# EAGLE design p0-001 (EAGLE 9.5.2)
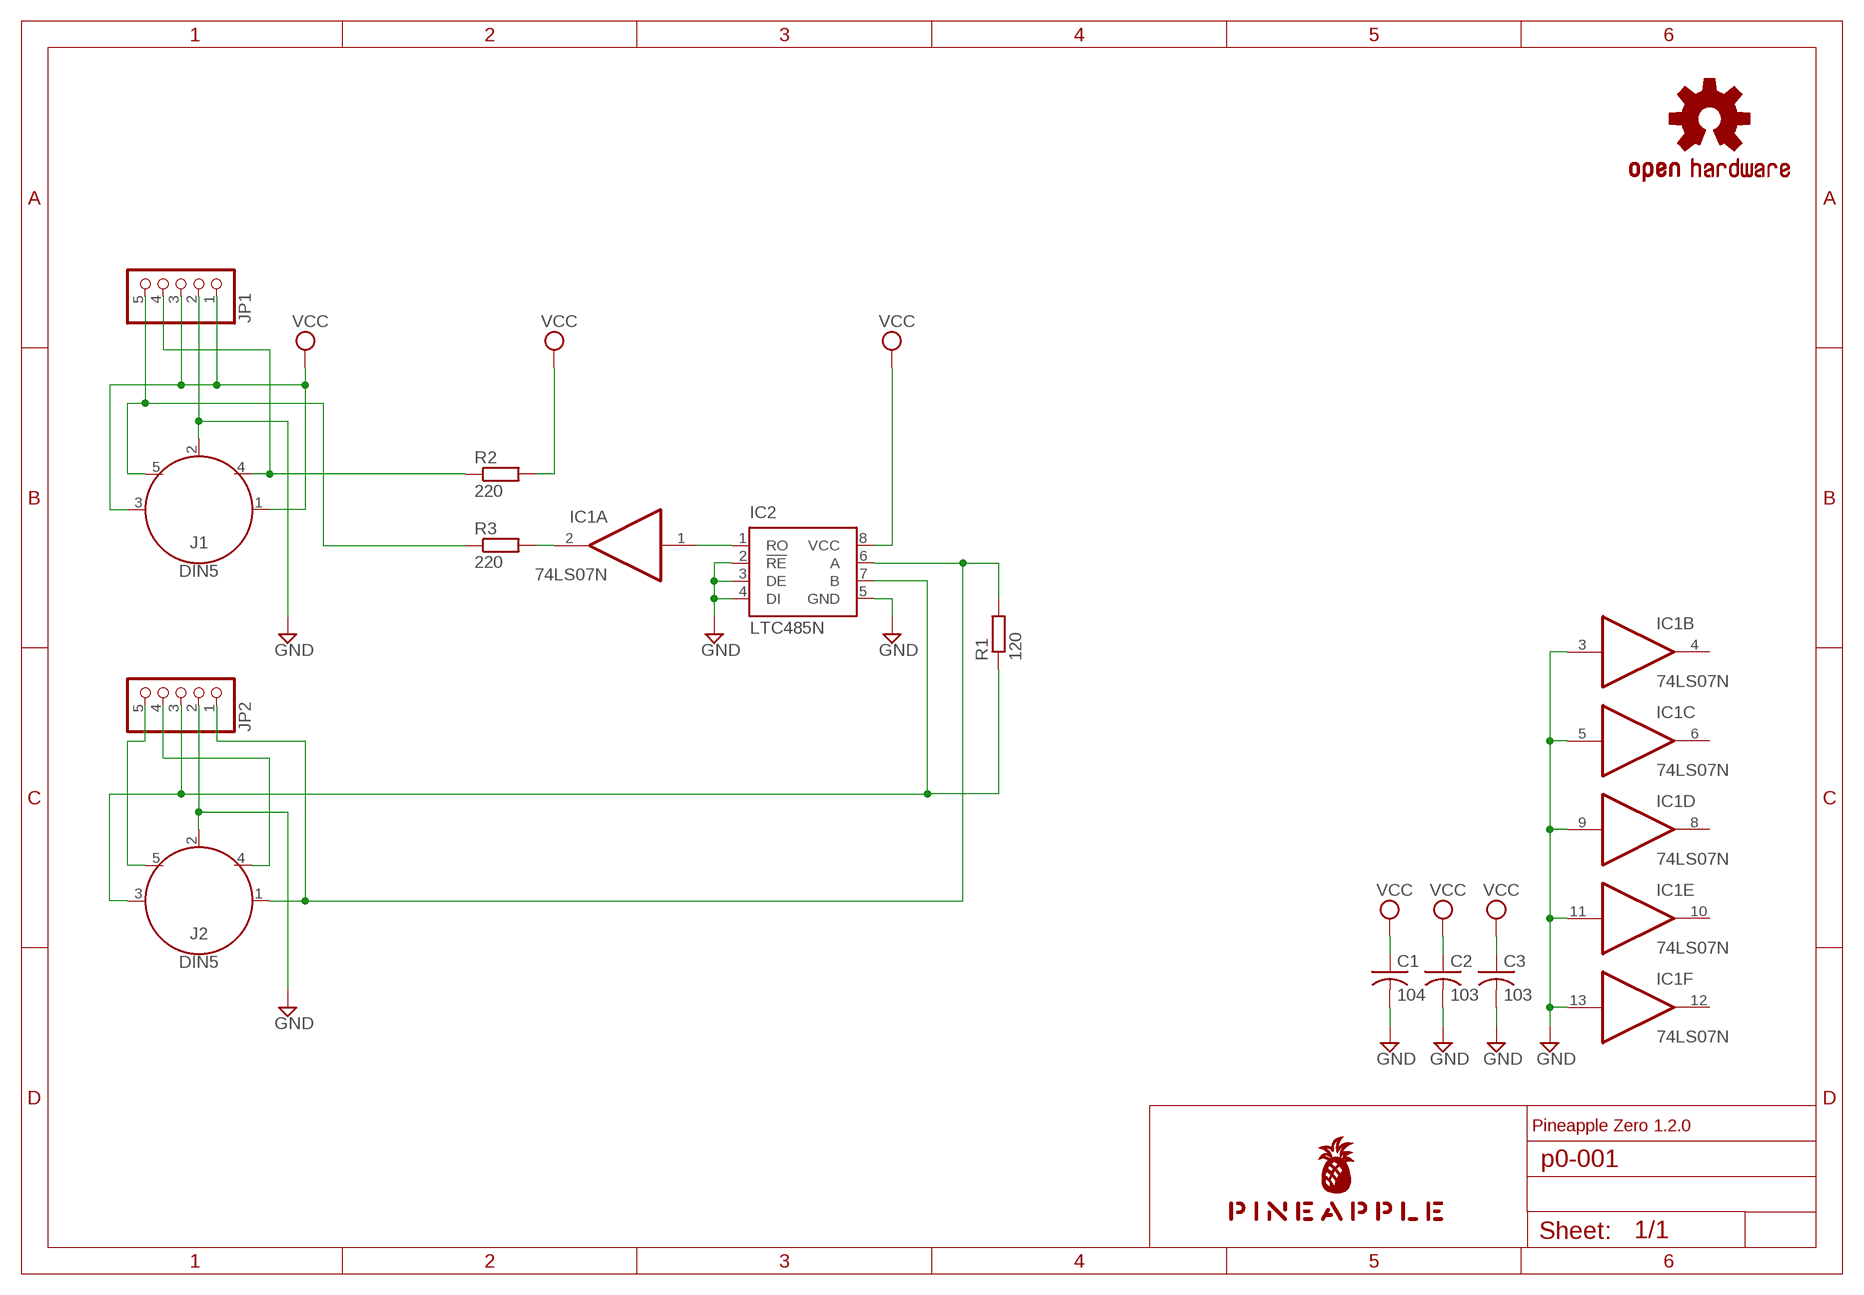
[diagram p0: schematic, sheet 1]

## Parts
C1  104  C-US025-025X050  [C025-025X050]
C2  103  C-US025-025X050  [C025-025X050]
C3  103  C-US025-025X050  [C025-025X050]
IC1  74LS07N  [DIL14]
IC2  LTC485N  [DIL08]
J1  DIN5  [DIN5-RA-PTH]
J2  DIN5  [DIN5-RA-PTH]
JP1  PINHD-1X5  [1X05]
JP2  PINHD-1X5  [1X05]
LOGO1  OSHW-LOGOS-COPPER  [OSHW-LOGO-S_COPPER]
R1  120  R-EU_0204/5  [0204/5]
R2  220  R-EU_0204/5  [0204/5]
R3  220  R-EU_0204/5  [0204/5]
U$1  PINEAPPLE450  [PINEAPPLE450]

## Nets
DUMMY4: J2.4 JP2.4
DUMMY5: J2.5 JP2.5
GND [power]: C1.2 C2.2 C3.2 IC1.3(B:I) IC1.5(C:I) IC1.9(D:I) IC1.11(E:I) IC1.13(F:I) IC2.2(!RE) IC2.3(DE) IC2.4(DI) IC2.5(GND) J1.2 J2.2 JP1.2 JP2.2
MOUTRTN: J1.5 JP1.5 R3.1
MOUTSND: J1.4 JP1.4 R2.1
N$1: IC1.2(A:O) R3.2
RX+: IC2.6(A) J2.1 JP2.1 R1.2
RX-: IC2.7(B) J2.3 JP2.3 R1.1
TX: IC1.1(A:I) IC2.1(RO)
VCC [power]: C1.1 C2.1 C3.1 IC2.8(VCC) J1.1 J1.3 JP1.1 JP1.3 R2.2
Unconnected: IC1.4(B:O) IC1.6(C:O) IC1.8(D:O) IC1.10(E:O) IC1.12(F:O)

## Notes on the sheet
- Pineapple Zero 1.2.0

## Power pins joined to a net without a drawn wire
GND: IC1.7(P:GND)
VCC: IC1.14(P:VCC)

## Library data of the parts
C1-C3 = rcl:C-US: CAPACITOR, American symbol; SPICEPREFIX: C
IC1 = 74xx-us:74*07: Hex BUFFER, open collector high-voltage output
IC2 = linear-technology:LTC485: Low Power RS485 Interface Transceiver Source: http://www.linear.com/pc/downloadDocument.do?navId=H0,C1,C1007,C1017,P2064,D1718; OC_FARNELL: unknown; OC_NEWARK: unknown
J1 J2 = SparkFun-Connectors:DIN5: DIN5 Connector - Female Right Angle (frequently used as a MIDI Jack connector) This type of connector and cable is frequently used for transmitting midi data (musical instrument digital interface). It is what you usually see on a keyboard or set of electronic drums. Learn more here <https://en.wikipedia.org/wiki/MIDI>. For more information on the pinout and electrical specifications of MIDI communications, please see the following resource: https://www.midi.org/specifications/item/midi-din-electrical-specification Here is the connector we sell at SparkFun: MIDI Connector - Female Right Angle <https://www.sparkfun.com/products/9536> (PRT-09536) Datasheet <hhttp://www.sparkfun.com/datasheets/Prototyping/Connectors/MIDI-RA.pdf> It is used on this SparkFun product: SparkFun MIDI Shield <https://www.sparkfun.com/products/12898> (DEV-12898); PROD_ID: CONN-09481
JP1 JP2 = pinhead:PINHD-1X5: PIN HEADER
LOGO1 = SparkFun-Aesthetics:OSHW-LOGO: Open-Source Hardware (OSHW) Logo This logo indicates the piece of hardware it is found on incorporates a OSHW license and/or adheres to the definition of open source hardware found here: http://freedomdefined.org/OSHW
R1-R3 = resistor:R-EU_: RESISTOR, European symbol
U$1 = pineapple:PINEAPPLE450

## Net classes
0 default: width 0.152 mm, drill 0.152 mm, clearance 0.152 mm
1 power: width 0.305 mm, drill 0.152 mm, clearance 0.152 mm to class 0, clearance 0.152 mm

## Board
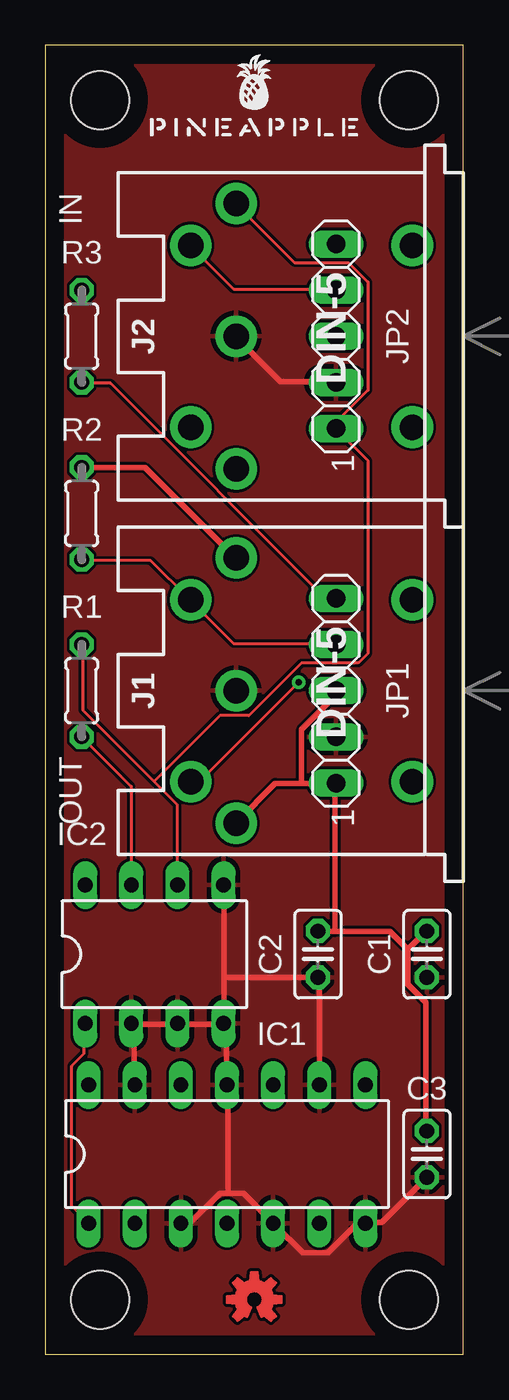
[diagram p1: board, top side]
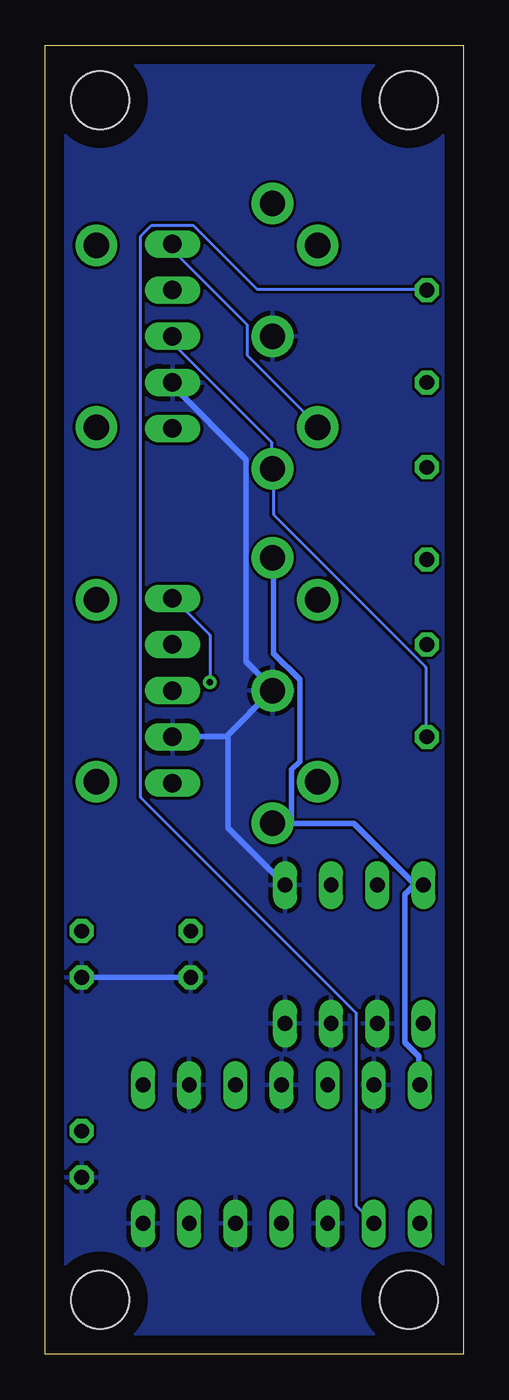
[diagram p2: board, bottom side, seen from below]

Size 23 x 72 mm. Coordinates in mm from the lower left corner, seen from the top.
Outline: 0,0 23,0 23,72 0,72 0,0
Copper layers (1*16): Top 0.035mm / dielectric 1.5mm / Bottom 0.035mm
Design rules "default": minimum track width 6mil, minimum drill 0.35mm, track to track 6mil, track to pad 6mil, pad to pad 6mil, via to via 6mil, smd to smd 6mil, copper to edge 40mil, drill to drill 6mil, minimum pad ring 10mil, minimum via ring 8mil, stop-mask expansion 4mil, vias tented up to drill 0mil, thermal gap 10mil
Holes 3.2 mm at 3,3 20,3 20,69 3,69
tRestrict: area 0,71 to 23,72; area 22,0 to 23,72; area 0,0 to 23,1; area 0,0 to 1,72
bRestrict: area 0,71 to 23,72; area 22,0 to 23,72; area 0,0 to 23,1; area 0,0 to 1,72

### Footprints (pad centres in the part's own frame; a part is rotated, then mirrored left to right if it is on the bottom)
C025-025X050 = drill 0.813 octagon: 1 -1.27,0; 2 1.27,0
DIL14 = drill 0.813 long: 1 -7.62,-3.81; 2 -5.08,-3.81; 3 -2.54,-3.81; 4 0,-3.81; 5 2.54,-3.81; 6 5.08,-3.81; 7 7.62,-3.81; 8 7.62,3.81; 9 5.08,3.81; 10 2.54,3.81; 11 0,3.81; 12 -2.54,3.81; 13 -5.08,3.81; 14 -7.62,3.81
DIL08 = drill 0.813 long: 1 -3.81,-3.81; 2 -1.27,-3.81; 3 1.27,-3.81; 4 3.81,-3.81; 5 3.81,3.81; 6 1.27,3.81; 7 -1.27,3.81; 8 -3.81,3.81
DIN5-RA-PTH = drill 1.4 pad 2.286: 1 7.3,12.5; 2 0,12.5; 3 -7.3,12.5; 4 5,15; 5 -5,15; 6 -5,2.8; 7 5,2.8
1X05 = drill 1.016 long: 1 -5.08,0; 2 -2.54,0; 3 0,0; 4 2.54,0; 5 5.08,0
0204/5 = drill 0.813 octagon: 1 -2.54,0; 2 2.54,0

### Placement (x,y rotation side)
C1  21,22 270 top
C2  15,22 270 top
C3  21,11 270 top
IC1  10,11 0 top
IC2  6,22 0 top
J1  23,36.5 90 top
J2  23,56 90 top
JP1  16,36.5 90 top
JP2  16,56 90 top
LOGO1  11.5,3 0 top
R1  2,36.5 90 top
R2  2,46.25 90 top
R3  2,56 90 top
U$1  11.5,67 0 top

### Tracks (layer width: path | path; a pad name or v marks a point on that pad's centre or on a via)
DUMMY4
  Top 0.152: JP2.4 15.93,58.6 10.36,58.6 8,60.96 J2.4
DUMMY5
  Bottom 0.152: JP2.5 15.93,61.04 15.93,60.66 11.89,56.62 11.89,54.94 8,51.05 J2.5
GND
  Top 0.305: JP2.2 15.93,53.49 12.95,53.49 10.52,55.93 J2.2 | IC1.13 4.88,14.86 4.88,18.06 4.8,18.14 IC2.2 4.95,18.14 7.24,18.14 IC2.3 7.39,18.14 9.68,18.14 IC2.4 | C3.2 20.95,9.68 18.52,7.24 17.68,7.24 IC1.7 17.53,7.09 17.07,7.09 15.54,5.56 14.17,5.56 12.65,7.09 IC1.5 12.5,7.24 10.9,8.84 10.06,8.84 | 10.06,8.84 9.6,8.84 8,7.24 7.47,7.24 IC1.3 | IC2.4 9.83,18.14 9.98,17.98 9.98,14.86 IC1.11 10.06,14.71 10.06,8.84 | 9.83,20.73 9.83,18.29 IC2.4 | 9.83,20.73 9.83,25.76 IC2.5 | 9.83,20.73 14.94,20.73 C2.2 15.09,20.65 15.09,14.86 IC1.9
  Bottom 0.305: 13.03,33.98 15.93,33.98 JP1.2 | 13.03,33.98 10.52,36.5 J1.2 10.52,36.65 11.96,38.1 11.96,49.23 15.93,53.19 15.93,53.42 JP2.2 | C1.2 20.95,20.73 C2.2 | 13.03,33.98 12.95,33.91 12.95,28.96 9.83,25.83 IC2.5
  pour Top: 0,0 23,0 23,72 0,72
  pour Bottom: 0,0 23,0 23,72 0,72
MOUTRTN  (via drill 0.35)
  Top 0.152: R3.1 2.06,53.42 3.58,53.42 15.39,41.6 15.93,41.6 JP1.5 | v13.95,36.96 8.53,31.55 8,31.55 J1.5
  Bottom 0.152: v13.95,36.96 13.95,39.55 15.93,41.53 JP1.5
MOUTSND
  Top 0.152: R2.1 2.06,43.66 5.79,43.66 7.92,41.53 J1.4 8,41.45 10.36,39.09 15.93,39.09 JP1.4
N$1
  Bottom 0.152: R3.2 2.06,58.6 11.35,58.6 14.86,62.1 17.14,62.1 17.75,61.49 17.75,30.63 5.87,18.75 5.87,8.15 4.95,7.24 IC1.2
RX+
  Top 0.152: 5.98,31.51 2.06,35.43 2.06,39.01 R1.2 | 5.98,31.51 7.24,30.25 7.24,25.83 IC2.6 | J2.1 10.52,63.25 13.72,60.05 16.69,60.05 17.75,58.98 17.75,53.03 16,51.28 16,50.98 JP2.1 16,50.9 17.75,49.15 17.75,38.56 17.22,38.02 14.1,38.02 11.2,35.13 9.6,35.13 5.98,31.51
RX-
  Top 0.152: IC2.7 4.72,25.83 4.72,31.24 2.06,33.91 R1.1
  Bottom 0.152: JP2.3 15.93,55.93 15.93,55.55 10.52,50.14 10.52,48.77 J2.3 10.44,48.69 10.44,46.18 2.06,37.8 2.06,33.98 R1.1
TX
  Top 0.152: IC2.1 2.13,18.14 2.13,16.54 1.45,15.85 1.45,8.15 2.36,7.24 IC1.1
VCC
  Top 0.305: 19.96,22.25 19.96,20.34 20.95,19.36 20.95,12.34 C3.1 | 19.96,22.25 20.95,23.24 C1.1 | 15.93,23.24 18.97,23.24 19.96,22.25 | 15.93,23.24 15.01,23.24 C2.1 | R2.2 2.06,48.77 5.49,48.77 10.44,43.81 J1.1 | 14.1,31.39 12.65,31.39 10.52,29.26 J1.3 | 14.1,31.39 15.93,31.39 JP1.1 15.93,31.24 15.93,23.24 | 14.1,31.39 14.1,34.37 15.93,36.2 15.93,36.5 JP1.3
  Bottom 0.305: IC1.14 2.44,14.86 2.44,16.38 3.2,17.14 3.2,25.3 2.74,25.76 IC2.8 2.21,25.83 2.67,25.83 6.02,29.18 10.44,29.18 J1.3 9.45,29.26 9.45,32.16 8.99,32.61 8.99,37.11 10.44,38.56 10.44,43.74 J1.1

### Text on the board
tPlace: IN | 1 | OUT | 1